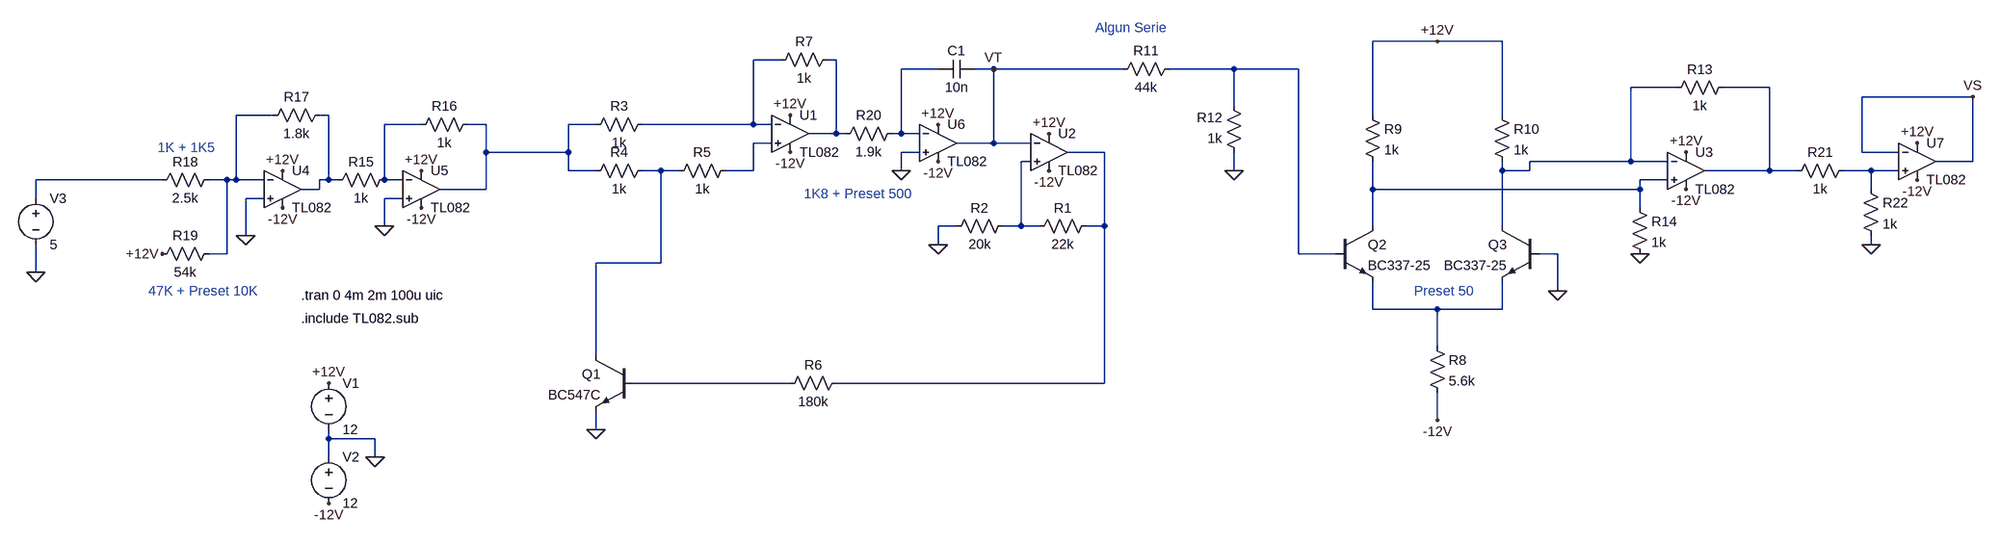
[diagram p0: schematic VCO.asc]
VCO.asc, the LTspice schematic file:
Version 4
SHEET 1 2744 848
WIRE 1360 -48 1248 -48
WIRE 1472 -48 1360 -48
WIRE 224 -16 176 -16
WIRE 320 -16 304 -16
WIRE 496 0 432 0
WIRE 592 0 560 0
WIRE 816 0 592 0
WIRE 1008 0 896 0
WIRE 1120 0 1008 0
WIRE 1776 32 1696 32
WIRE 1936 32 1856 32
WIRE 2288 48 2096 48
WIRE 1008 64 1008 0
WIRE -656 80 -720 80
WIRE -560 80 -576 80
WIRE 1248 80 1248 -48
WIRE 1472 80 1472 -48
WIRE -400 96 -464 96
WIRE -288 96 -320 96
WIRE -96 96 -144 96
WIRE 176 96 176 -16
WIRE 176 96 -16 96
WIRE 208 96 176 96
WIRE 320 112 320 -16
WIRE 320 112 272 112
WIRE 336 112 320 112
WIRE 432 112 432 0
WIRE 432 112 416 112
WIRE 464 112 432 112
WIRE 208 128 176 128
WIRE 592 128 592 0
WIRE 592 128 528 128
WIRE 656 128 592 128
WIRE -288 144 -288 96
WIRE -144 144 -144 96
WIRE -144 144 -288 144
WIRE 464 144 432 144
WIRE 784 144 720 144
WIRE 2096 144 2096 48
WIRE 2160 144 2096 144
WIRE 656 160 640 160
WIRE 1696 160 1696 32
WIRE 1696 160 1520 160
WIRE 1760 160 1696 160
WIRE 2288 160 2288 48
WIRE 2288 160 2224 160
WIRE -144 176 -144 144
WIRE -96 176 -144 176
WIRE 16 176 -16 176
WIRE 48 176 16 176
WIRE 176 176 176 128
WIRE 176 176 128 176
WIRE 432 176 432 144
WIRE 1008 176 1008 144
WIRE 1472 176 1472 160
WIRE 1520 176 1520 160
WIRE 1520 176 1472 176
WIRE 1936 176 1936 32
WIRE 1936 176 1824 176
WIRE 1984 176 1936 176
WIRE 2112 176 2064 176
WIRE 2160 176 2112 176
WIRE -848 192 -1072 192
WIRE -736 192 -768 192
WIRE -720 192 -720 80
WIRE -720 192 -736 192
WIRE -672 192 -720 192
WIRE -560 192 -560 80
WIRE -560 192 -576 192
WIRE -544 192 -560 192
WIRE -464 192 -464 96
WIRE -432 192 -464 192
WIRE 1760 192 1712 192
WIRE -576 208 -576 192
WIRE -576 208 -608 208
WIRE -288 208 -288 144
WIRE -288 208 -368 208
WIRE 1248 208 1248 160
WIRE 1712 208 1712 192
WIRE 1712 208 1248 208
WIRE 2112 208 2112 176
WIRE -1072 224 -1072 192
WIRE -672 224 -704 224
WIRE -432 224 -464 224
WIRE 1712 240 1712 208
WIRE -464 272 -464 224
WIRE 528 272 496 272
WIRE 640 272 640 160
WIRE 640 272 608 272
WIRE 672 272 640 272
WIRE 784 272 784 144
WIRE 784 272 752 272
WIRE 1248 272 1248 208
WIRE 1472 272 1472 176
WIRE -704 288 -704 224
WIRE 496 304 496 272
WIRE 2112 304 2112 288
WIRE -736 320 -736 192
WIRE -736 320 -768 320
WIRE 1120 320 1120 0
WIRE 1184 320 1120 320
WIRE 1568 320 1536 320
WIRE 16 336 16 176
WIRE 16 336 -96 336
WIRE -1072 352 -1072 304
WIRE 1568 384 1568 320
WIRE 1248 416 1248 368
WIRE 1360 416 1248 416
WIRE 1472 416 1472 368
WIRE 1472 416 1360 416
WIRE 1360 480 1360 416
WIRE -96 496 -96 336
WIRE 240 544 -32 544
WIRE 784 544 784 272
WIRE 784 544 320 544
WIRE 1360 608 1360 560
WIRE -96 624 -96 592
WIRE -560 640 -560 624
WIRE -480 640 -560 640
WIRE -560 672 -560 640
WIRE -480 672 -480 640
FLAG -480 672 0
FLAG -560 544 +12V
FLAG 688 112 +12V
FLAG 240 80 +12V
FLAG -560 752 -12V
FLAG 688 176 -12V
FLAG 240 144 -12V
FLAG 496 304 0
FLAG -96 624 0
FLAG 1360 -48 +12V
FLAG 1360 608 -12V
FLAG 1568 384 0
FLAG 1008 176 0
FLAG 1792 208 -12V
FLAG 1792 144 +12V
FLAG 1712 320 0
FLAG -704 288 0
FLAG -640 176 +12V
FLAG -400 176 +12V
FLAG -640 240 -12V
FLAG -400 240 -12V
FLAG -848 320 +12V
FLAG -1072 352 0
FLAG -464 272 0
FLAG 496 96 +12V
FLAG 496 160 -12V
FLAG 592 0 VT
FLAG 432 176 0
FLAG 2192 128 +12V
FLAG 2192 192 -12V
FLAG 2112 304 0
FLAG 2288 48 VS
SYMBOL Opamps\\opamp2 240 48 R0
SYMATTR InstName U1
SYMATTR Value TL082
SYMBOL Opamps\\opamp2 688 80 R0
SYMATTR InstName U2
SYMATTR Value TL082
SYMBOL voltage -560 528 R0
WINDOW 123 0 0 Left 2
WINDOW 39 0 0 Left 2
SYMATTR InstName V1
SYMATTR Value 12
SYMBOL voltage -560 656 R0
WINDOW 123 0 0 Left 2
WINDOW 39 0 0 Left 2
SYMATTR InstName V2
SYMATTR Value 12
SYMBOL cap 560 -16 R90
WINDOW 0 0 32 VBottom 2
WINDOW 3 32 32 VTop 2
SYMATTR InstName C1
SYMATTR Value 10n
SYMBOL res 768 256 R90
WINDOW 0 0 56 VBottom 2
WINDOW 3 32 56 VTop 2
SYMATTR InstName R1
SYMATTR Value 22k
SYMBOL res 624 256 R90
WINDOW 0 0 56 VBottom 2
WINDOW 3 32 56 VTop 2
SYMATTR InstName R2
SYMATTR Value 20k
SYMBOL res 0 80 R90
WINDOW 0 0 56 VBottom 2
WINDOW 3 32 56 VTop 2
SYMATTR InstName R3
SYMATTR Value 1k
SYMBOL res 0 160 R90
WINDOW 0 0 56 VBottom 2
WINDOW 3 32 56 VTop 2
SYMATTR InstName R4
SYMATTR Value 1k
SYMBOL res 32 192 R270
WINDOW 0 32 56 VTop 2
WINDOW 3 0 56 VBottom 2
SYMATTR InstName R5
SYMATTR Value 1k
SYMBOL npn -32 496 M0
SYMATTR InstName Q1
SYMATTR Value BC547C
SYMBOL res 336 528 R90
WINDOW 0 0 56 VBottom 2
WINDOW 3 32 56 VTop 2
SYMATTR InstName R6
SYMATTR Value 180k
SYMBOL npn 1184 272 R0
SYMATTR InstName Q2
SYMATTR Value BC337-25
SYMBOL npn 1536 272 M0
SYMATTR InstName Q3
SYMATTR Value BC337-25
SYMBOL res 1344 464 R0
SYMATTR InstName R8
SYMATTR Value 5.6k
SYMBOL res 1232 64 R0
SYMATTR InstName R9
SYMATTR Value 1k
SYMBOL res 1456 64 R0
SYMATTR InstName R10
SYMATTR Value 1k
SYMBOL res 912 -16 R90
WINDOW 0 0 56 VBottom 2
WINDOW 3 32 56 VTop 2
SYMATTR InstName R11
SYMATTR Value 44k
SYMBOL res 1024 160 R180
WINDOW 0 36 76 Left 2
WINDOW 3 36 40 Left 2
SYMATTR InstName R12
SYMATTR Value 1k
SYMBOL Opamps\\opamp2 1792 112 R0
SYMATTR InstName U3
SYMATTR Value TL082
SYMBOL res 1872 16 R90
WINDOW 0 0 56 VBottom 2
WINDOW 3 32 56 VTop 2
SYMATTR InstName R13
SYMATTR Value 1k
SYMBOL res 1696 224 R0
SYMATTR InstName R14
SYMATTR Value 1k
SYMBOL Opamps\\opamp2 -640 144 R0
SYMATTR InstName U4
SYMATTR Value TL082
SYMBOL Opamps\\opamp2 -400 144 R0
SYMATTR InstName U5
SYMATTR Value TL082
SYMBOL res -448 176 R90
WINDOW 0 0 56 VBottom 2
WINDOW 3 32 56 VTop 2
SYMATTR InstName R15
SYMATTR Value 1k
SYMBOL res -304 80 R90
WINDOW 0 0 56 VBottom 2
WINDOW 3 32 56 VTop 2
SYMATTR InstName R16
SYMATTR Value 1k
SYMBOL res -560 64 R90
WINDOW 0 0 56 VBottom 2
WINDOW 3 32 56 VTop 2
SYMATTR InstName R17
SYMATTR Value 1.8k
SYMBOL res -752 176 R90
WINDOW 0 0 56 VBottom 2
WINDOW 3 32 56 VTop 2
SYMATTR InstName R18
SYMATTR Value 2.5k
SYMBOL res -752 304 R90
WINDOW 0 0 56 VBottom 2
WINDOW 3 32 56 VTop 2
SYMATTR InstName R19
SYMATTR Value 54k
SYMBOL voltage -1072 208 R0
WINDOW 123 0 0 Left 2
WINDOW 39 0 0 Left 2
SYMATTR InstName V3
SYMATTR Value 5
SYMBOL res 320 -32 R90
WINDOW 0 0 56 VBottom 2
WINDOW 3 32 56 VTop 2
SYMATTR InstName R7
SYMATTR Value 1k
SYMBOL res 432 96 R90
WINDOW 0 0 56 VBottom 2
WINDOW 3 32 56 VTop 2
SYMATTR InstName R20
SYMATTR Value 1.9k
SYMBOL Opamps\\opamp2 496 64 R0
SYMATTR InstName U6
SYMATTR Value TL082
SYMBOL Opamps\\opamp2 2192 96 R0
SYMATTR InstName U7
SYMATTR Value TL082
SYMBOL res 2080 160 R90
WINDOW 0 0 56 VBottom 2
WINDOW 3 32 56 VTop 2
SYMATTR InstName R21
SYMATTR Value 1k
SYMBOL res 2096 192 R0
SYMATTR InstName R22
SYMATTR Value 1k
TEXT -608 432 Left 2 !.include TL082.sub
TEXT -608 392 Left 2 !.tran 0 4m 2m 100u uic
TEXT -856 136 Left 2 ;1K + 1K5
TEXT -872 384 Left 2 ;47K + Preset 10K
TEXT 768 -72 Left 2 ;Algun Serie
TEXT 264 216 Left 2 ;1K8 + Preset 500
TEXT 1320 384 Left 2 ;Preset 50

The netlist it stands for:
* VCO.asc
XU1 N011 N001 +12V -12V N002 TL082  ; pins In+ In- V+ V- OUT
XU2 N013 VT +12V -12V N012 TL082  ; pins In+ In- V+ V- OUT
V1 +12V 0 12
V2 0 -12V 12
C1 VT N003 10n
R1 N012 N013 22k
R2 N013 0 20k
R3 N001 N010 1k
R4 N014 N010 1k
R5 N014 N011 1k
Q1 N014 N019 0 0 BC547C
R6 N012 N019 180k
Q2 N017 N004 N018 0 BC337-25
Q3 N005 0 N018 0 BC337-25
R8 N018 -12V 5.6k
R9 +12V N017 1k
R10 +12V N005 1k
R11 N004 VT 44k
R12 0 N004 1k
XU3 N017 N005 +12V -12V N006 TL082  ; pins In+ In- V+ V- OUT
R13 N006 N005 1k
R14 N017 0 1k
XU4 0 N007 +12V -12V N008 TL082  ; pins In+ In- V+ V- OUT
XU5 0 N009 +12V -12V N010 TL082  ; pins In+ In- V+ V- OUT
R15 N009 N008 1k
R16 N010 N009 1k
R17 N008 N007 1.8k
R18 N007 N016 2.5k
R19 N007 +12V 54k
V3 N016 0 5
R7 N002 N001 1k
R20 N003 N002 1.9k
XU6 0 N003 +12V -12V VT TL082  ; pins In+ In- V+ V- OUT
XU7 N015 VS +12V -12V VS TL082  ; pins In+ In- V+ V- OUT
R21 N015 N006 1k
R22 N015 0 1k
.model NPN NPN
.model PNP PNP
.lib standard.bjt
.include TL082.sub
.tran 0 4m 2m 100u uic
* 1K + 1K5
* 47K + Preset 10K
* Algun Serie
* 1K8 + Preset 500
* Preset 50
.backanno
.end